# Altium schematic sheet LUT_2_3_Input.SchDoc
size A
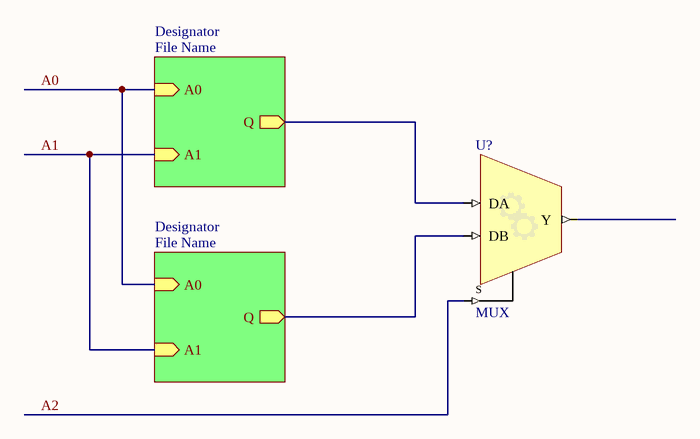
[diagram p0: LUT_2_3_Input.SchDoc]

## Parts
U?  MUX

## Sub-sheets
Designator = File Name: A0 (in), A1 (in), Q (out)
Designator = File Name: A0 (in), A1 (in), Q (out)

## Nets
A0: sheet Designator/A0, sheet Designator/A0
A1: sheet Designator/A1, sheet Designator/A1
A2: U?.S
NetU?_DA: U?.DA ; sheet Designator/Q
NetU?_DB: U?.DB ; sheet Designator/Q

Not connected (* = marked no-connect by the designer): U? Y

## Library data of the parts
U? = MUX: Configurable Mutliplexer; ConfigurationParameters: {}Version[1.0]{}ShowEnable[False]{}BusInputs[False]{}BusOutputs[False]{}SignalWidth[1]{}Type[Multiplexer]{}RegisterOutputs[False]{}NegativeClockEdge[False]{}ShowPinNames[True]{}InvertSingleSignal[False]{}SignalCount[2]{}Invert0[False]{}Invert1[False]{}; ConfiguratorName: GENERIC_MULTIPLEXER; LastRevisionNo: 1.00.00; Published: 31-Dec-2008; Publisher: Altium Limited